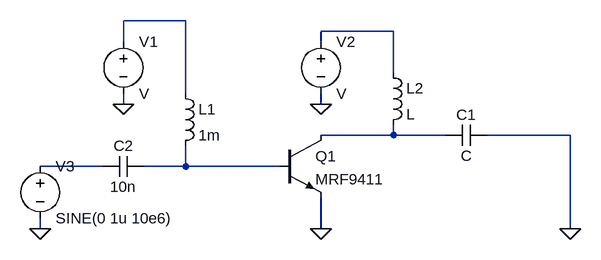
[diagram p0: schematic MRF9411_AC.asc]
MRF9411_AC.asc, the LTspice schematic file:
Version 4
SHEET 1 880 680
WIRE -144 -112 -240 -112
WIRE 176 -96 64 -96
WIRE -240 -80 -240 -112
WIRE 64 -80 64 -96
WIRE 176 -32 176 -96
WIRE -144 0 -144 -112
WIRE -240 16 -240 0
WIRE 64 16 64 0
WIRE 176 64 176 48
WIRE 176 64 64 64
WIRE 256 64 176 64
WIRE 448 64 320 64
WIRE -272 112 -368 112
WIRE -144 112 -144 80
WIRE -144 112 -208 112
WIRE 0 112 -144 112
WIRE -368 208 -368 192
WIRE 64 208 64 160
WIRE 448 208 448 64
FLAG 64 208 0
FLAG -240 16 0
FLAG 64 16 0
FLAG -368 208 0
FLAG 448 208 0
SYMBOL npn 0 64 R0
SYMATTR InstName Q1
SYMATTR Value MRF9411
SYMBOL ind -160 -16 R0
SYMATTR InstName L1
SYMATTR Value 1m
SYMBOL ind 160 -48 R0
SYMATTR InstName L2
SYMBOL cap 320 48 R90
WINDOW 0 0 32 VBottom 2
WINDOW 3 32 32 VTop 2
SYMATTR InstName C1
SYMBOL cap -208 96 R90
WINDOW 0 0 32 VBottom 2
WINDOW 3 32 32 VTop 2
SYMATTR InstName C2
SYMATTR Value 10n
SYMBOL voltage -240 -96 R0
SYMATTR InstName V1
SYMBOL voltage 64 -96 R0
SYMATTR InstName V2
SYMBOL voltage -368 96 R0
WINDOW 123 0 0 Left 0
WINDOW 39 0 0 Left 0
SYMATTR InstName V3
SYMATTR Value SINE(0 1u 10e6)

The netlist it stands for:
* MRF9411_AC.asc
Q1 N003 N005 0 0 MRF9411
L1 N001 N005 1m
L2 N002 N003 L
C1 0 N003 C
C2 N005 N004 10n
V1 N001 0 V
V2 N002 0 V
V3 N004 0 SINE(0 1u 10e6)
.model NPN NPN
.model PNP PNP
.lib standard.bjt
.backanno
.end